# Altium project Project-Files-v2.PrjPcb
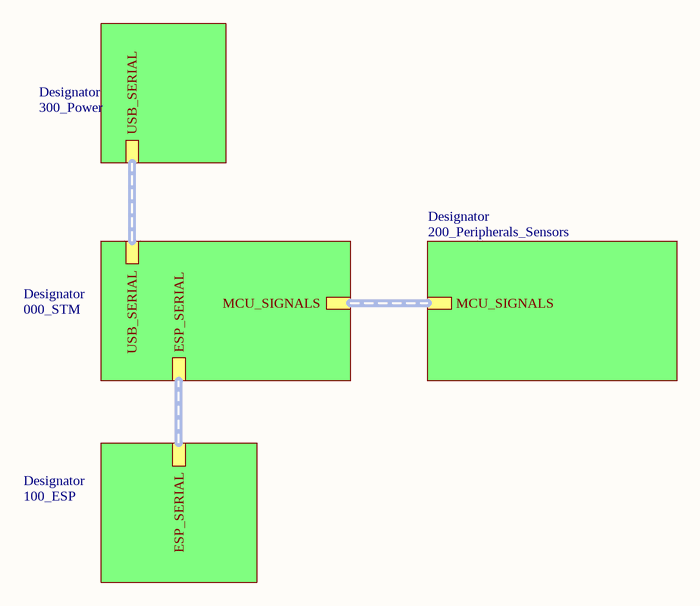
[diagram p0: Main.SchDoc]
5 sheets, 75 parts. Net scope: hierarchical (ports join the sheet entries above them; power ports are global).
Board file: PBC-full.PcbDoc
Sheets:
  Main.SchDoc
    Designator = 000_STM.SchDoc
    Designator = 100_ESP.SchDoc
    Designator = 200_Peripherals_Sensors.SchDoc
    Designator = 300_Power.SchDoc

## Sheet Main.SchDoc
size A; SheetNumber: 1; SheetTotal: 5

### Sub-sheets
Designator = 000_STM: MCU_SIGNALS (harness MCU_SIGNALS), USB_SERIAL (harness USB_SERIAL), ESP_SERIAL (harness ESP_SERIAL)
Designator = 100_ESP: ESP_SERIAL (harness ESP_SERIAL)
Designator = 200_Peripherals_Sensors: MCU_SIGNALS (harness MCU_SIGNALS)
Designator = 300_Power: USB_SERIAL (harness USB_SERIAL)

## Sheet 000_STM.SchDoc
size A; SheetNumber: 2; SheetTotal: 5
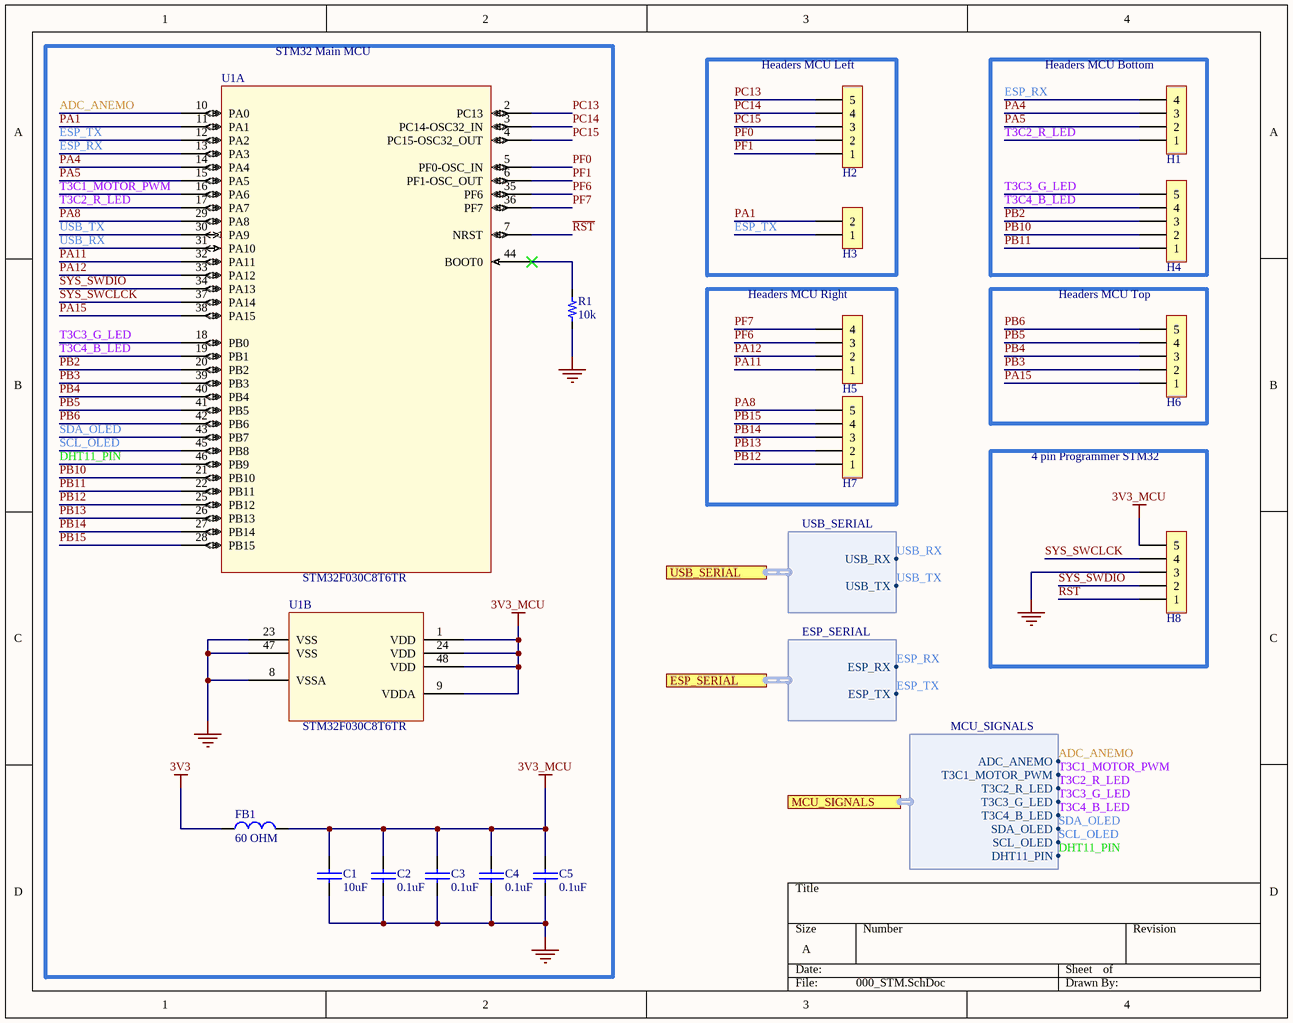
[diagram p1: 000_STM.SchDoc]

### Parts
C1  value 10uF  [0805_cap]  (hidden comment: 10uF 25V)
C2  value 0.1uF  [0603_cap]  (hidden comment: 0.1uF 50V)
C3  value 0.1uF  [0603_cap]  (hidden comment: 0.1uF 50V)
C4  value 0.1uF  [0603_cap]  (hidden comment: 0.1uF 50V)
C5  value 0.1uF  [0603_cap]  (hidden comment: 0.1uF 50V)
FB1  value 60 OHM  [0603_fb]  (hidden comment: 60OHM 2A)
H1  4x1  [H_4x1_TH_2.54mm]  (value not drawn)  (no BOM)
H2  5x1  [H_5x1_TH_100mil]  (value not drawn)  (no BOM)
H3  2x1  [H_2x1_TH_100mil]  (value not drawn)  (no BOM)
H4  5x1  [H_5x1_TH_100mil]  (value not drawn)  (no BOM)
H5  4x1  [H_4x1_TH_2.54mm]  (value not drawn)  (no BOM)
H6  5x1  [H_5x1_TH_100mil]  (value not drawn)  (no BOM)
H7  5x1  [H_5x1_TH_100mil]  (value not drawn)  (no BOM)
H8  5x1  [H_5x1_TH_100mil]  (value not drawn)  (no BOM)
R1  value 10k  [0603_res]  (hidden comment: 10k 1/10W)
U1  STM32F030C8T6TR  [LQFP48_7x7mm]  (parts A,B of 2)

### Blocks framed on the sheet
STM32 Main MCU: C1-C5 FB1 R1 U1
Headers MCU Left: H2 H3
Headers MCU Bottom: H1 H4
Headers MCU Right: H5 H7
Headers MCU Top: H6
4 pin Programmer STM32: H8

### Ports
ESP_SERIAL (harness ESP_SERIAL, see Main[2B], 100_ESP[3A]), MCU_SIGNALS (harness MCU_SIGNALS, see Main[2B], 200_Peripherals_Sensors[1D]), USB_SERIAL (harness USB_SERIAL, see Main[2B], 300_Power[3B])

### Harnesses
MCU_SIGNALS: ADC_ANEMO, T3C1_MOTOR_PWM, T3C2_R_LED, T3C3_G_LED, T3C4_B_LED, SDA_OLED, SCL_OLED, DHT11_PIN
USB_SERIAL: USB_RX, USB_TX
ESP_SERIAL: ESP_RX, ESP_TX

### Nets
3V3: FB1.1
3V3_MCU: C1.1 C2.1 C3.1 C4.1 C5.1 FB1.2 H8.5 U1.1(VDD) U1.9(VDDA) U1.24(VDD) U1.48(VDD)
GND: C1.2 C2.2 C3.2 C4.2 C5.2 H8.3 R1.1 U1.8(VSSA) U1.23(VSS) U1.47(VSS)
ADC_ANEMO: U1.10(PA0) ; port MCU_SIGNALS.ADC_ANEMO
DHT11_PIN: U1.46(PB9) ; port MCU_SIGNALS.DHT11_PIN
ESP_RX: H1.4 U1.13(PA3) ; port ESP_SERIAL.ESP_RX
ESP_TX: H3.1 U1.12(PA2) ; port ESP_SERIAL.ESP_TX
PA1: H3.2 U1.11(PA1)
PA4: H1.3 U1.14(PA4)
PA5: H1.2 U1.15(PA5)
PA8: H7.5 U1.29(PA8)
PA11: H5.1 U1.32(PA11)
PA12: H5.2 U1.33(PA12)
PA15: H6.1 U1.38(PA15)
PB2: H4.3 U1.20(PB2)
PB3: H6.2 U1.39(PB3)
PB4: H6.3 U1.40(PB4)
PB5: H6.4 U1.41(PB5)
PB6: H6.5 U1.42(PB6)
PB10: H4.2 U1.21(PB10)
PB11: H4.1 U1.22(PB11)
PB12: H7.1 U1.25(PB12)
PB13: H7.2 U1.26(PB13)
PB14: H7.3 U1.27(PB14)
PB15: H7.4 U1.28(PB15)
PC13: H2.5 U1.2(PC13)
PC14: H2.4 U1.3(PC14-OSC32_IN)
PC15: H2.3 U1.4(PC15-OSC32_OUT)
PF0: H2.2 U1.5(PF0-OSC_IN)
PF1: H2.1 U1.6(PF1-OSC_OUT)
PF6: H5.3 U1.35(PF6)
PF7: H5.4 U1.36(PF7)
~{RST}: H8.1 U1.7(NRST)
SCL_OLED: U1.45(PB8) ; port MCU_SIGNALS.SCL_OLED
SDA_OLED: U1.43(PB7) ; port MCU_SIGNALS.SDA_OLED
SYS_SWCLCK: H8.4 U1.37(PA14)
SYS_SWDIO: H8.2 U1.34(PA13)
T3C1_MOTOR_PWM: U1.16(PA6) ; port MCU_SIGNALS.T3C1_MOTOR_PWM
T3C2_R_LED: H1.1 U1.17(PA7) ; port MCU_SIGNALS.T3C2_R_LED
T3C3_G_LED: H4.5 U1.18(PB0) ; port MCU_SIGNALS.T3C3_G_LED
T3C4_B_LED: H4.4 U1.19(PB1) ; port MCU_SIGNALS.T3C4_B_LED
USB_RX: U1.31(PA10) ; port USB_SERIAL.USB_RX
USB_TX: U1.30(PA9) ; port USB_SERIAL.USB_TX
NetR1_2: R1.2 U1.44(BOOT0)

### Library data of the parts
C1 = Cap_10uF_0805_25V_: 25V 10uF X5R ±10% 0805 Multilayer Ceramic Capacitors MLCC - SMD/SMT ROHS; Manufacturer: Samsung Electro-Mechanics; Manufacturer Part Number: CL21A106KAYNNNE; Supplier 1: LCSC; Supplier Part Number 1: C15850; ComponentLink1Description: LCSC; ComponentLink1URL: https://lcsc.com/product-detail/Multilayer-Ceramic-Capacitors-MLCC-SMD-SMT_Samsung-Electro-Mechanics-CL21A106KAYNNNE_C15850.html
C2-C5 = Cap_0.1uF_0603_50V: 50V 100nF Y5V -20%~+80% 0603 Multilayer Ceramic Capacitors MLCC - SMD/SMT ROHS; Manufacturer: Walsin Tech Corp; Manufacturer Part Number: 0603F104Z500CT; Supplier 1: LCSC; Supplier Part Number 1: C83060; ComponentLink1Description: LCSC; ComponentLink1URL: https://www.lcsc.com/product-detail/Multilayer-Ceramic-Capacitors-MLCC-SMD-SMT_Walsin-Tech-Corp-0603F104Z500CT_C83060.html
FB1 = FB_60_0603_2A: 2A 1 100mΩ 60Ω@100MHz ±25% 0603 Ferrite Beads ROHS; Manufacturer: TAI-TECH; Manufacturer Part Number: HCB1608KF-600T20; ComponentLink1Description: LCSC; ComponentLink1URL: https://www.lcsc.com/product-detail/Ferrite-Beads_TAI-TECH-HCB1608KF-600T20_C369516.html; Supplier 1: LCSC; Supplier Part Number 1: C369516
H1 H5 = H_Male_4x1_TH_100mil: ComponentLink1Description: LCSC
H2 H4 H6-H8 = H_Male_5x1_TH_100mil: ComponentLink1Description: LCSC
H3 = H_Male_2x1_TH_100mil: ComponentLink1Description: LCSC
R1 = Res_10k_0603_1/10W: RES SMD 10k OHM 5% 1/10W 0603; Manufacturer: FOJAN; Manufacturer Part Number: FRC0603J103TS; ComponentLink1URL: https://www.lcsc.com/product-detail/Chip-Resistor-Surface-Mount_FOJAN-FRC0603J103TS_C2930027.html; Supplier 1: LCSC; Supplier Part Number 1: C2930027; ComponentLink1Description: LCSC
U1 = IC_STM32F030C8T6TR_LQFP48_7x7MM: IC MCU 32BIT 64KB FLASH 48LQFP; Manufacturer: STMicroelectronics; Manufacturer part number: STM32F030C8T6TR; Supplier 1: LCSC; Supplier Part Number 1: C23922; ComponentLink1Description: LCSC; ComponentLink1URL: https://www.lcsc.com/product-detail/ST-Microelectronics_STMicroelectronics-STM32F030C8T6_C23922.html

## Sheet 100_ESP.SchDoc
size A; SheetNumber: 3; SheetTotal: 5
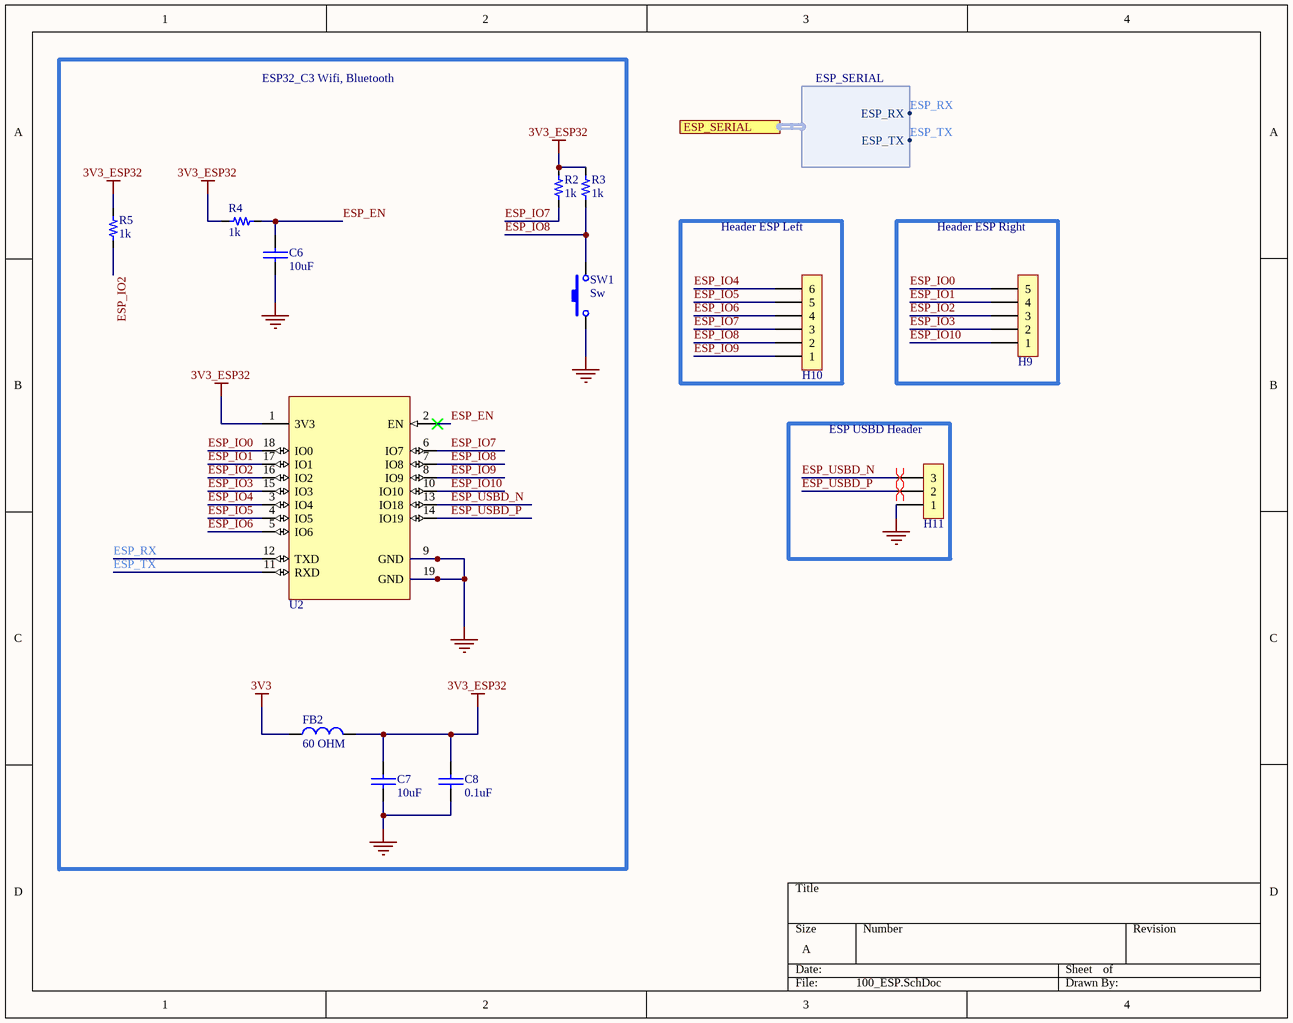
[diagram p2: 100_ESP.SchDoc]

### Parts
C6  value 10uF  [0805_cap]  (hidden comment: 10uF 25V)
C7  value 10uF  [0805_cap]  (hidden comment: 10uF 25V)
C8  value 0.1uF  [0603_cap]  (hidden comment: 0.1uF 50V)
FB2  value 60 OHM  [0603_fb]  (hidden comment: 60OHM 2A)
H9  5x1  [H_5x1_TH_100mil]  (value not drawn)  (no BOM)
H10  6x1  [H_6x1_TH_100mil]  (value not drawn)  (no BOM)
H11  3x1  [H_3X1_TH_100mil]  (value not drawn)  (no BOM)
R2  value 1k  [0603_res]  (hidden comment: 1k 1/10W)
R3  value 1k  [0603_res]  (hidden comment: 1k 1/10W)
R4  value 1k  [0603_res]  (hidden comment: 1k 1/10W)
R5  value 1k  [0603_res]  (hidden comment: 1k 1/10W)
SW1  Sw  [Sw_PUSH_4.5x4.5x5mm]
U2  ESP32-C3-WROOM-02-N4  [ESP32-C3-WROOM-02-N4]  (value not drawn)

### Blocks framed on the sheet
ESP32_C3 Wifi, Bluetooth: C6-C8 FB2 R2-R5 SW1 U2
Header ESP Left: H10
Header ESP Right: H9
ESP USBD Header: H11

### Ports
ESP_SERIAL (harness ESP_SERIAL, see Main[2B], 000_STM[3C])

### Harnesses
ESP_SERIAL: ESP_RX, ESP_TX

### Nets
3V3: FB2.1
3V3_ESP32: C7.1 C8.1 FB2.2 R2.2 R3.2 R4.2 R5.2 U2.1(3V3)
GND: C6.2 C7.2 C8.2 H11.1 SW1.1 U2.9(GND) U2.19(GND)
ESP_EN: C6.1 R4.1 U2.2(EN)
ESP_IO0: H9.5 U2.18(IO0)
ESP_IO1: H9.4 U2.17(IO1)
ESP_IO2: H9.3 R5.1 U2.16(IO2)
ESP_IO3: H9.2 U2.15(IO3)
ESP_IO4: H10.6 U2.3(IO4)
ESP_IO5: H10.5 U2.4(IO5)
ESP_IO6: H10.4 U2.5(IO6)
ESP_IO7: H10.3 R2.1 U2.6(IO7)
ESP_IO8: H10.2 R3.1 SW1.2 U2.7(IO8)
ESP_IO9: H10.1 U2.8(IO9)
ESP_IO10: H9.1 U2.10(IO10)
ESP_RX: U2.12(TXD) ; port ESP_SERIAL.ESP_RX
ESP_TX: U2.11(RXD) ; port ESP_SERIAL.ESP_TX
ESP_USBD_N: H11.3 U2.13(IO18)
ESP_USBD_P: H11.2 U2.14(IO19)

### Layout directives
differential pair; differential pair class USB_2.0_ESP: ESP_USBD_N, ESP_USBD_P

### Library data of the parts
C6 C7 = Cap_10uF_0805_25V_: as C1 on sheet 000_STM; Supplier 1: LCSC; Supplier Part Number 1: C15850; ComponentLink1Description: LCSC; ComponentLink1URL: https://lcsc.com/product-detail/Multilayer-Ceramic-Capacitors-MLCC-SMD-SMT_Samsung-Electro-Mechanics-CL21A106KAYNNNE_C15850.html
C8 = Cap_0.1uF_0603_50V: as C2 on sheet 000_STM; Supplier 1: LCSC; Supplier Part Number 1: C83060; ComponentLink1Description: LCSC; ComponentLink1URL: https://www.lcsc.com/product-detail/Multilayer-Ceramic-Capacitors-MLCC-SMD-SMT_Walsin-Tech-Corp-0603F104Z500CT_C83060.html
FB2 = FB_60_0603_2A: as FB1 on sheet 000_STM; ComponentLink1Description: LCSC; ComponentLink1URL: https://www.lcsc.com/product-detail/Ferrite-Beads_TAI-TECH-HCB1608KF-600T20_C369516.html; Supplier 1: LCSC; Supplier Part Number 1: C369516
H9 = H_Male_5x1_TH_100mil: ComponentLink1Description: LCSC
H10 = H_Male_6x1_TH_100mil: ComponentLink1Description: LCSC
H11 = H_Male_3x1_TH_100mil: ComponentLink1Description: LCSC
R2-R5 = Res_1k_0603_1/10W: RES SMD 1k OHM 5% 1/10W 0603; Manufacturer: FOJAN; Manufacturer Part Number: FRC0603J102 TS; ComponentLink1URL: https://www.lcsc.com/product-detail/Chip-Resistor-Surface-Mount_FOJAN-FRC0603J102-TS_C2907113.html; Supplier 1: LCSC; Supplier Part Number 1: C2907113; ComponentLink1Description: LCSC
SW1 = Sw_PUSH_4.5x4.5x5.0xmm: SWITCH TACTILE SPST-NO 0.05A 12V; Manufacturer: BZCN; Manufacturer Part Number: TSC015A05026A; Supplier 1: LCSC; Supplier Part Number 1: C2888509; Last modified by: N-A.Potosi; Last modified date: 20190222; ComponentLink1Description: LCSC; ComponentLink1URL: https://www.lcsc.com/product-detail/Tactile-Switches_BZCN-TSC015A05026A_C2888509.html
U2 = MCU_ESP32-C3-WROOM-02-N4: RF TXRX MOD BT WIFI PCB TH SMD; Manufacturer: Espressif Systems; Manufacturer Part Number: ESP32-C3-WROOM-02-N4; Supplier 1: LCSC; Supplier Part Number 1: C2934560; ComponentLink1Description: LCSC; ComponentLink1URL: https://lcsc.com/product-detail/WiFi-Modules_Espressif-Systems-ESP32-C3-WROOM-02-N4_C2934560.html

## Sheet 200_Peripherals_Sensors.SchDoc
size A; SheetNumber: 4; SheetTotal: 5
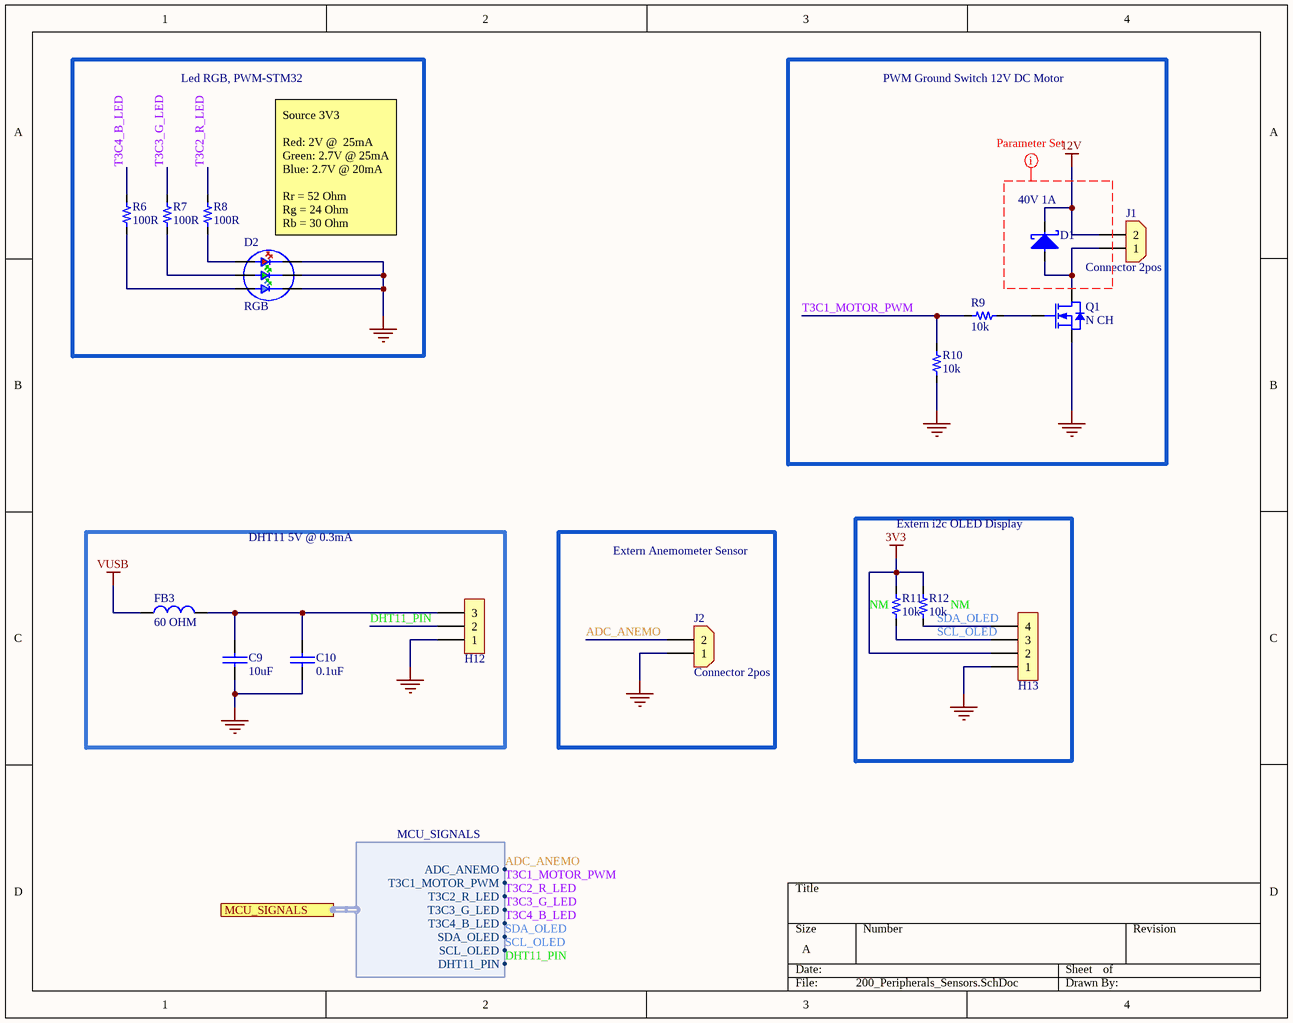
[diagram p3: 200_Peripherals_Sensors.SchDoc]

### Parts
C9  value 10uF  [0805_cap]  (hidden comment: 10uF 25V)
C10  value 0.1uF  [0603_cap]  (hidden comment: 0.1uF 50V)
D1  40V 1A  [SOD_123]
D2  RGB  [RGB_NS_3.5X3.7]
FB3  value 60 OHM  [0603_fb]  (hidden comment: 60OHM 2A)
H12  3x1  [H_3X1_TH_100mil]  (value not drawn)  (no BOM)
H13  4x1  [H_4x1_TH_2.54mm]  (value not drawn)  (no BOM)
J1  Connector 2pos  [CON_2x1_TH_5MM]
J2  Connector 2pos  [CON_2x1_TH_5MM]
Q1  N CH  [SOT_23_3]
R6  value 100R  [0603_res]  (hidden comment: 100R 1/10W)
R7  value 100R  [0603_res]  (hidden comment: 100R 1/10W)
R8  value 100R  [0603_res]  (hidden comment: 100R 1/10W)
R9  value 10k  [0603_res]  (hidden comment: 10k 1/10W)
R10  value 10k  [0603_res]  (hidden comment: 10k 1/10W)
R11  value 10k  Usage: NM  [0603_res]  (hidden comment: 10k 1/10W)
R12  value 10k  Usage: NM  [0603_res]  (hidden comment: 10k 1/10W)

### Blocks framed on the sheet
Led RGB, PWM-STM32: D2 R6-R8
PWM Ground Switch 12V DC Motor: D1 J1 Q1 R9 R10
DHT11 5V @ 0.3mA: C9 C10 FB3 H12
Extern Anemometer Sensor: J2
Extern i2c OLED Display: H13 R11 R12

### Ports
MCU_SIGNALS (harness MCU_SIGNALS, see Main[3B], 000_STM[3D])

### Harnesses
MCU_SIGNALS: ADC_ANEMO, T3C1_MOTOR_PWM, T3C2_R_LED, T3C3_G_LED, T3C4_B_LED, SDA_OLED, SCL_OLED, DHT11_PIN

### Nets
3V3: H13.2 R11.2 R12.2
12V: D1.1 J1.2
GND: C9.2 C10.2 D2.1 D2.2 D2.3 H12.1 H13.1 J2.1 Q1.2(S) R10.1
VUSB: FB3.1
ADC_ANEMO: J2.2 ; port MCU_SIGNALS.ADC_ANEMO
DHT11_PIN: H12.2 ; port MCU_SIGNALS.DHT11_PIN
SCL_OLED: H13.3 R11.1 ; port MCU_SIGNALS.SCL_OLED
SDA_OLED: H13.4 R12.1 ; port MCU_SIGNALS.SDA_OLED
T3C1_MOTOR_PWM: R9.2 R10.2 ; port MCU_SIGNALS.T3C1_MOTOR_PWM
T3C2_R_LED: R8.2 ; port MCU_SIGNALS.T3C2_R_LED
T3C3_G_LED: R7.2 ; port MCU_SIGNALS.T3C3_G_LED
T3C4_B_LED: R6.2 ; port MCU_SIGNALS.T3C4_B_LED
NetC9_1: C9.1 C10.1 FB3.2 H12.3
NetD1_2: D1.2 J1.1 Q1.3(D)
NetD2_4: D2.4 R8.1
NetD2_5: D2.5 R7.1
NetD2_6: D2.6 R6.1
NetQ1_1: Q1.1(G) R9.1

### Layout directives
net class 12V_2A: (no net found under the mark)

### Notes on the sheet
- (near D2) Source 3V3
  Red: 2V @  25mA
  Green: 2.7V @ 25mA
  Blue: 2.7V @ 20mA
  Rr = 52 Ohm
  Rg = 24 Ohm
  Rb = 30 Ohm

### Library data of the parts
C9 = Cap_10uF_0805_25V_: as C1 on sheet 000_STM; Supplier 1: LCSC; Supplier Part Number 1: C15850; ComponentLink1Description: LCSC; ComponentLink1URL: https://lcsc.com/product-detail/Multilayer-Ceramic-Capacitors-MLCC-SMD-SMT_Samsung-Electro-Mechanics-CL21A106KAYNNNE_C15850.html
C10 = Cap_0.1uF_0603_50V: as C2 on sheet 000_STM; Supplier 1: LCSC; Supplier Part Number 1: C83060; ComponentLink1Description: LCSC; ComponentLink1URL: https://www.lcsc.com/product-detail/Multilayer-Ceramic-Capacitors-MLCC-SMD-SMT_Walsin-Tech-Corp-0603F104Z500CT_C83060.html
D1 = D_Schottky_40V_1A_SOD_123F: DIODE SCHOTTKY 40V 1A SOD123F; Manufacturer: Shanghai Prisemi Elec; Manufacturer Part Number: PSBD1DF40V1H; Supplier 1: LCSC; Supplier Part Number 1: C110730; ComponentLink1Description: LCSC; ComponentLink1URL: https://www.lcsc.com/product-detail/Switching-Diode_Shanghai-Prisemi-Elec-PSBD1DF40V1H_C110730.html
D2 = LED_RGB_3535_SMD: -30℃~+85℃ RGB 110° 3535(mm) Light Emitting Diodes (LED) ROHS; Manufacturer: Foshan NationStar Optoelectronics; Manufacturer Part Number: RS-3535MWAM; Supplier 1: LCSC; Supplier Part Number 1: C842778; ComponentLink1Description: LCSC; ComponentLink1URL: https://www.lcsc.com/product-detail/Light-Emitting-Diodes-LED_Foshan-NationStar-Optoelectronics-RS-3535MWAM_C842778.html
FB3 = FB_60_0603_2A: as FB1 on sheet 000_STM; ComponentLink1Description: LCSC; ComponentLink1URL: https://www.lcsc.com/product-detail/Ferrite-Beads_TAI-TECH-HCB1608KF-600T20_C369516.html; Supplier 1: LCSC; Supplier Part Number 1: C369516
H12 = H_Male_3x1_TH_100mil: ComponentLink1Description: LCSC
H13 = H_Male_4x1_TH_100mil: ComponentLink1Description: LCSC
J1 J2 = Con_2x1_TH_5mm: 2POS 5MM; Manufacturer: JILN; Manufacturer Part Number: JL126-50002G01; Supplier 1: LCSC; Supplier Part Number 1: C394556; ComponentLink1Description: Digi-Key; ComponentLink1URL: https://www.lcsc.com/product-detail/Screw-terminal_JILN-JL126-50002G01_C394556.html
Q1 = Q_NFET_20V_3.2A_SOT23: MOSFET N-CH 20V SOT23; Manufacturer: Doeshare; Manufacturer Part Number: DN2302S; Supplier 1: LCSC; Supplier Part Number 1: C2931750; ComponentLink1Description: LCSC; ComponentLink1URL: https://www.lcsc.com/product-detail/MOSFETs_Doeshare-DN2302S_C2931750.html
R6-R8 = Res_100R_0603_1/10W: RES SMD 100R OHM 5% 1/10W 0603; Manufacturer: FOJAN; Manufacturer Part Number: FRC0603J101 TS; ComponentLink1URL: https://www.lcsc.com/product-detail/Chip-Resistor-Surface-Mount_FOJAN-FRC0603J101-TS_C2907089.html; Supplier 1: LCSC; Supplier Part Number 1: C2907089; ComponentLink1Description: LCSC
R9-R12 = Res_10k_0603_1/10W: as R1 on sheet 000_STM; ComponentLink1URL: https://www.lcsc.com/product-detail/Chip-Resistor-Surface-Mount_FOJAN-FRC0603J103TS_C2930027.html; Supplier 1: LCSC; Supplier Part Number 1: C2930027; ComponentLink1Description: LCSC

## Sheet 300_Power.SchDoc
size A; SheetNumber: 5; SheetTotal: 5
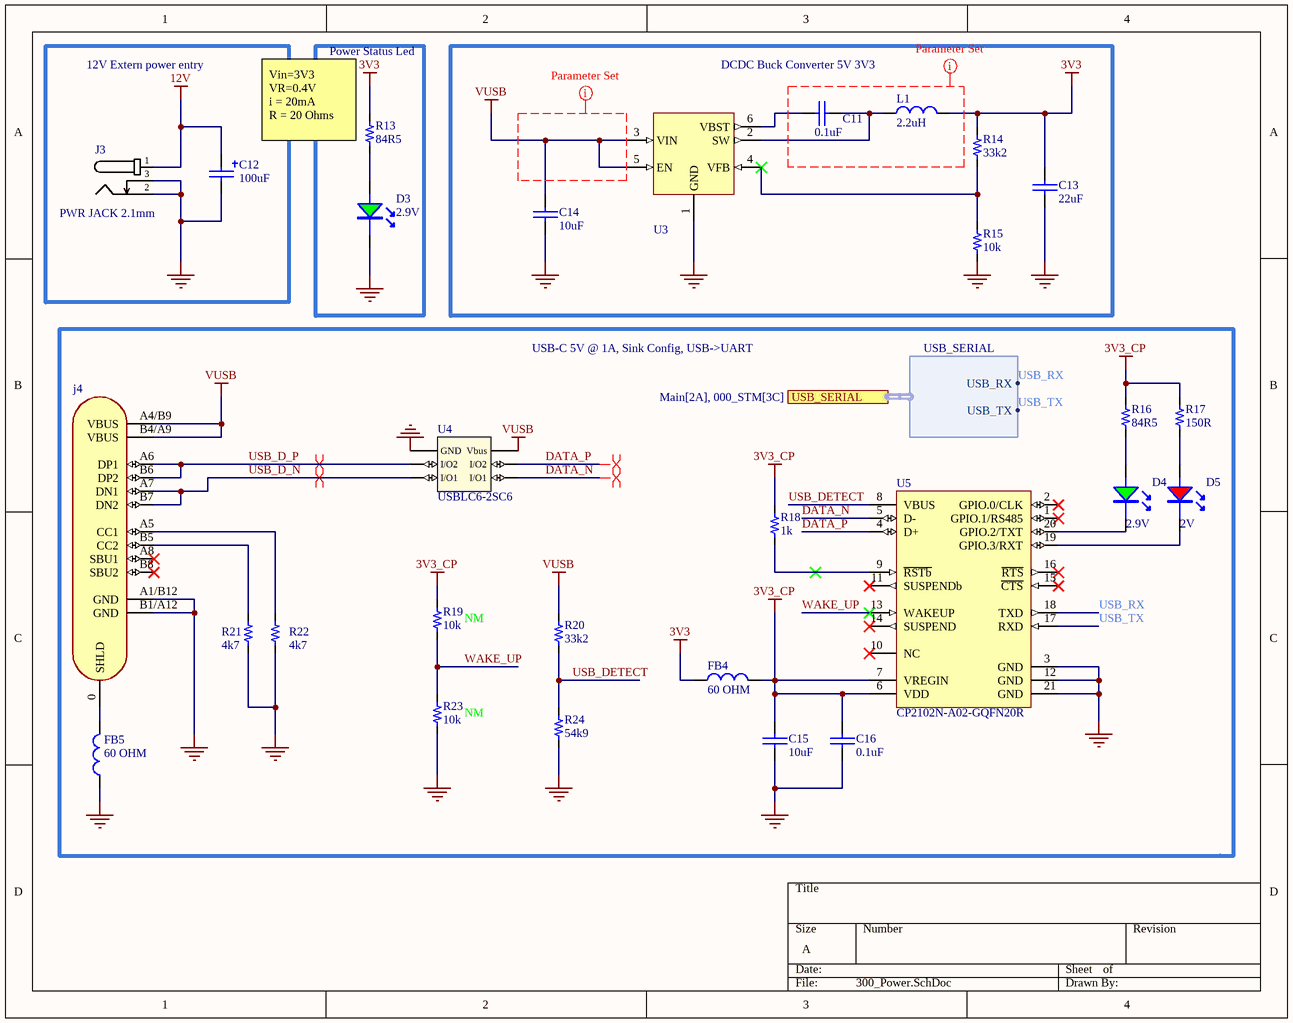
[diagram p4: 300_Power.SchDoc]

### Parts
C11  value 0.1uF  [0603_cap]  (hidden comment: 0.1uF 50V)
C12  value 100uF  [CAP_TH_2.5MM_6.3*12MM]  (hidden comment: 100uF 35V)
C13  value 22uF  [0603_cap]  (hidden comment: 22uF 10V)
C14  value 10uF  [0603_cap]  (hidden comment: 10uF 10V)
C15  value 10uF  [0603_cap]  (hidden comment: 10uF 10V)
C16  value 0.1uF  [0603_cap]  (hidden comment: 0.1uF 50V)
D3  2.9V  [0805_LED]
D4  2.9V  [0805_LED]
D5  2V  [0805_LED]
FB4  value 60 OHM  [0603_fb]  (hidden comment: 60OHM 2A)
FB5  value 60 OHM  [0603_fb]  (hidden comment: 60OHM 2A)
J3  PWR JACK 2.1mm  [CON_POWER_BARREL_2.1MM_3CONN]
j4  USB C  [CON_USB_C_16P_RA]  (value not drawn)
L1  value 2.2uH  [Ind_5.8*5.2_NS]  (hidden comment: 2.2uH 4A)
R13  value 84R5  [0603_res]  (hidden comment: 84R5 1/10W)
R14  value 33k2  [0603_res]  (hidden comment: 33k2 1/10W)
R15  value 10k  [0603_res]  (hidden comment: 10k 1/10W)
R16  value 84R5  [0603_res]  (hidden comment: 84R5 1/10W)
R17  value 150R  [0603_res]  (hidden comment: 150R 1/10W)
R18  value 1k  [0603_res]  (hidden comment: 1k 1/10W)
R19  value 10k  Usage: NM  [0603_res]  (hidden comment: 10k 1/10W)
R20  value 33k2  [0603_res]  (hidden comment: 33k2 1/10W)
R21  value 4k7  [0603_res]  (hidden comment: 4k7 1/10W)
R22  value 4k7  [0603_res]  (hidden comment: 4k7 1/10W)
R23  value 10k  Usage: NM  [0603_res]  (hidden comment: 10k 1/10W)
R24  value 54k9  [0603_res]  (hidden comment: 54k9 1/10W)
U3  TPS564201DDCR  [SOT_23_6]  (value not drawn)
U4  USBLC6-2SC6  [SOT_23_6]
U5  CP2102N-A02-GQFN20R  [WFQFN_20_EP_3X3MM]

### Blocks framed on the sheet
12V Extern power entry: C12 J3
Power Status Led: D3 R13
DCDC Buck Converter 5V 3V3: C11 C13 C14 L1 R14 R15 U3
USB-C 5V @ 1A, Sink Config, USB->UART: C15 C16 D4 D5 FB4 FB5 j4 R16-R24 U4 U5

### Ports
USB_SERIAL (harness USB_SERIAL, see Main[2A], 000_STM[3C])

### Harnesses
USB_SERIAL: USB_RX, USB_TX

### Nets
3V3: C13.1 FB4.1 L1.2 R13.1 R14.2
3V3_CP: C15.1 C16.1 FB4.2 R16.2 R17.2 R18.2 R19.2 U5.6(VDD) U5.7(VREGIN)
12V: C12.1 J3.1
GND: C12.2 C13.2 C14.2 C15.2 C16.2 D3.2 FB5.1 J3.2 J3.3 j4.A1/B12(GND) j4.B1/A12(GND) R15.1 R21.1 R22.1 R23.1 R24.1 U3.1(GND) U4.2(GND) U5.3(GND) U5.12(GND) U5.21(GND)
VUSB: C14.1 j4.A4/B9(VBUS) j4.B4/A9(VBUS) R20.2 U3.3(VIN) U3.5(EN) U4.5(Vbus)
DATA_N: U4.6(I/O1) U5.5(D-)
DATA_P: U4.4(I/O2) U5.4(D+)
USB_D_N: j4.A7(DN1) j4.B7(DN2) U4.1(I/O1)
USB_D_P: j4.A6(DP1) j4.B6(DP2) U4.3(I/O2)
USB_DETECT: R20.1 R24.2 U5.8(VBUS)
USB_RX: U5.18(TXD) ; port USB_SERIAL.USB_RX
USB_TX: U5.17(RXD) ; port USB_SERIAL.USB_TX
WAKE_UP: R19.1 R23.2 U5.13(WAKEUP)
NetC11_1: C11.1 L1.1 U3.2(SW)
NetC11_2: C11.2 U3.6(VBST)
NetD3_1: D3.1(A) R13.2
NetD4_1: D4.1(A) R16.1
NetD4_2: D4.2 U5.20(GPIO.2/TXT)
NetD5_1: D5.1(A) R17.1
NetD5_2: D5.2 U5.19(GPIO.3/RXT)
NetFB5_2: FB5.2 j4.0(SHLD)
Netj4_A5: j4.A5(CC1) R22.2
Netj4_B5: j4.B5(CC2) R21.2
NetR14_1: R14.1 R15.2 U3.4(VFB)
NetR18_1: R18.1 U5.9(~{RSTb})

Not connected (* = marked no-connect by the designer): j4 A8(SBU1)* B8(SBU2)*; U5 1(GPIO.1/RS485)* 2(GPIO.0/CLK)* 10(NC)* 11(SUSPENDb)* 14(SUSPEND)* 15(~{CTS})* 16(~{RTS})*

### Layout directives
differential pair; differential pair class USB_2.0_MCU: DATA_N, DATA_P, USB_D_N, USB_D_P
net class 5V_1A: (no net found under the mark)

### Notes on the sheet
- (near R13) Vin=3V3
  VR=0.4V
  i = 20mA
  R = 20 Ohms

### Library data of the parts
C11 C16 = Cap_0.1uF_0603_50V: as C2 on sheet 000_STM; Supplier 1: LCSC; Supplier Part Number 1: C83060; ComponentLink1Description: LCSC; ComponentLink1URL: https://www.lcsc.com/product-detail/Multilayer-Ceramic-Capacitors-MLCC-SMD-SMT_Walsin-Tech-Corp-0603F104Z500CT_C83060.html
C12 = Cap_100uF_ALU_TH_35V: 100uF 35V ±20% Plugin,D6.3xL12mm Aluminum Electrolytic Capacitors - Leaded ROHS; Manufacturer: HRK; Manufacturer Part Number: 35V100uF CD110; Supplier 1: LCSC; Supplier Part Number 1: C2960381; ComponentLink1Description: LCSC; ComponentLink1URL: https://lcsc.com/product-detail/Aluminum-Electrolytic-Capacitors-Leaded_HRK-35V100uF-CD110_C2960381.html
C13 = Cap_22uF_0603_10V: 10V 22uF X5R ±20% 0603 Multilayer Ceramic Capacitors MLCC - SMD/SMT ROHS; Manufacturer: HRE; Manufacturer Part Number: CGA0603X5R226M100JT; Supplier 1: LCSC; Supplier Part Number 1: C6119863; ComponentLink1Description: LCSC; ComponentLink1URL: https://lcsc.com/product-detail/Multilayer-Ceramic-Capacitors-MLCC-SMD-SMT_HRE-CGA0603X5R226M100JT_C6119863.html
C14 C15 = Cap_10uF_0603_10V: 10V 10uF X5R ±10% 0603 Multilayer Ceramic Capacitors MLCC - SMD/SMT ROHS; Manufacturer: CCTC; Manufacturer Part Number: TCC0603X5R106K100CT; Supplier 1: LCSC; Supplier Part Number 1: C380314; ComponentLink1Description: LCSC; ComponentLink1URL: https://www.lcsc.com/product-detail/Multilayer-Ceramic-Capacitors-MLCC-SMD-SMT_CCTC-TCC0603X5R106K100CT_C380314.html
D3 D4 = LED_0805_Green: LED GREEN CLEAR 0805 SMD; Manufacturer: XINGLIGHT; Manufacturer Part Number: XL-2012UGC; Supplier 1: LCSC; Supplier Part Number 1: C965815; ComponentLink1Description: LCSC; ComponentLink1URL: https://www.lcsc.com/product-detail/Light-Emitting-Diodes-LED_XINGLIGHT-XL-2012UGC_C965815.html
D5 = LED_0805_RED: LED RED CLEAR 0805 SMD; Manufacturer: XINGLIGHT; Manufacturer Part Number: XL-2012SURC; Supplier 1: LCSC; Supplier Part Number 1: C965812; ComponentLink1Description: LCSC; ComponentLink1URL: https://www.lcsc.com/product-detail/Light-Emitting-Diodes-LED_XINGLIGHT-XL-2012SURC_C965812.html
FB4 FB5 = FB_60_0603_2A: as FB1 on sheet 000_STM; ComponentLink1Description: LCSC; ComponentLink1URL: https://www.lcsc.com/product-detail/Ferrite-Beads_TAI-TECH-HCB1608KF-600T20_C369516.html; Supplier 1: LCSC; Supplier Part Number 1: C369516
J3 = Con_Power_Jack_2.1mm_3pins: CONN PWR JACK 2X5.5MM SOLDER; Manufacturer: HCTL; Manufacturer Part Number: HC-DC-005-2.0T; Supplier 1: LCSC; Supplier Part Number 1: C3010533; ComponentLink1Description: LCSC; ComponentLink1URL: https://www.lcsc.com/product-detail/AC-DC-Power-Connectors_HCTL-HC-DC-005-2-0T_C3010533.html
j4 = CON_USB_TYPEC_16P: 3A USB 3.1 1 Surface Mount 16P Female -40℃~+85℃ Type-C SMD USB Connectors ROHS; Manufacturer: SHOU HAN; Manufacturer Part Number: TYPE-C-3.1-16PIN; Supplier 1: LCSC; Supplier Part Number 1: C7507405; ComponentLink1Description: LCSC; ComponentLink1URL: https://lcsc.com/product-detail/USB-Connectors_SHOU-HAN-TYPE-C-3-1-16PIN_C7507405.html
L1 = Inductor_2.2uH_4A_5.8*5.2mm: 4A 2.2uH ±20% 22.1mΩ SMD,5.8x5.2mm Inductors (SMD) ROHS; Manufacturer: SHOU HAN; Manufacturer Part Number: CY54-2.2UH; Supplier 1: LCSC; Supplier Part Number 1: C2929427; ComponentLink1Description: LCSC; ComponentLink1URL: https://lcsc.com/product-detail/Inductors-SMD_SHOU-HAN-CY54-2-2UH_C2929427.html
R13 R16 = Res_84R5_0603_1/10W: 100mW Thick Film Resistor 50V ±100ppm/℃ ±1% 84.5Ω 0603 Chip Resistor - Surface Mount ROHS; Manufacturer: LIZ Elec; Manufacturer Part Number: CR0603FA84R5G; ComponentLink1URL: https://lcsc.com/product-detail/Chip-Resistor-Surface-Mount_LIZ-Elec-CR0603FA84R5G_C101216.html; Supplier 1: LCSC; Supplier Part Number 1: C101216; ComponentLink1Description: LCSC
R14 R20 = Res_33k2_0603_1/10W: 100mW Thick Film Resistor 75V ±100ppm/℃ ±1% 33.2kΩ 0603 Chip Resistor - Surface Mount ROHS; Manufacturer: YAGEO; Manufacturer Part Number: RC0603FR-0733K2L; ComponentLink1URL: https://lcsc.com/product-detail/Chip-Resistor-Surface-Mount_YAGEO-RC0603FR-0733K2L_C185338.html; Supplier 1: LCSC; Supplier Part Number 1: C185338; ComponentLink1Description: LCSC
R15 R19 R23 = Res_10k_0603_1/10W: as R1 on sheet 000_STM; ComponentLink1URL: https://www.lcsc.com/product-detail/Chip-Resistor-Surface-Mount_FOJAN-FRC0603J103TS_C2930027.html; Supplier 1: LCSC; Supplier Part Number 1: C2930027; ComponentLink1Description: LCSC
R17 = Res_150R_0603_1/10W: 100mW Thick Film Resistor 75V ±100ppm/℃ ±1% 150Ω 0603 Chip Resistor - Surface Mount ROHS; Manufacturer: RALEC; Manufacturer Part Number: RTT031500FTP; ComponentLink1URL: https://lcsc.com/product-detail/Chip-Resistor-Surface-Mount_RALEC-RTT031500FTP_C103302.html; Supplier 1: LCSC; Supplier Part Number 1: C103302; ComponentLink1Description: LCSC
R18 = Res_1k_0603_1/10W: as R2 on sheet 100_ESP; ComponentLink1URL: https://www.lcsc.com/product-detail/Chip-Resistor-Surface-Mount_FOJAN-FRC0603J102-TS_C2907113.html; Supplier 1: LCSC; Supplier Part Number 1: C2907113; ComponentLink1Description: LCSC
R21 R22 = Res_4k7_0603_1/10W: 100mW Thick Film Resistor 75V ±1% 4.7kΩ 0603 Chip Resistor - Surface Mount ROHS; Manufacturer: VO; Manufacturer Part Number: SCR0603F4K7; ComponentLink1URL: https://lcsc.com/product-detail/Chip-Resistor-Surface-Mount_VO-SCR0603F4K7_C3016318.html; Supplier 1: LCSC; Supplier Part Number 1: C3016318; ComponentLink1Description: LCSC
R24 = Res_54k9_0603_1/10W: 100mW Thick Film Resistor 75V ±100ppm/℃ ±1% 54.9kΩ 0603 Chip Resistor - Surface Mount ROHS; Manufacturer: YAGEO; Manufacturer Part Number: RC0603FR-0754K9L; ComponentLink1URL: https://lcsc.com/product-detail/Chip-Resistor-Surface-Mount_YAGEO-RC0603FR-0754K9L_C185321.html; Supplier 1: LCSC; Supplier Part Number 1: C185321; ComponentLink1Description: LCSC
U3 = DCDC_SW_BUCK_4A_SOT23-6: IC REG BUCK ADJ 4A SOT23; Manufacturer: Texas Instruments; Manufacturer Part Number: TPS564201DDCR; Supplier 1: LCSC; Supplier Part Number 1: C464812; ComponentLink1Description: LCSC; ComponentLink1URL: https://lcsc.com/product-detail/DC-DC-Converters_Texas-Instruments-TPS564201DDCR_C464812.html
U4 = TVS_5.25V_2CH_SOT_23_6: TVS DIODE 5.25V 17V SOT23-6; Manufacturer: STMicroelectronics; ComponentLink1Description: LCSC; ComponentLink1URL: https://www.lcsc.com/product-detail/ESD-Protection-Devices_STMicroelectronics-USBLC6-2SC6_C7519.html; Supplier 1: LCSC; Manufacturer Part Number: USBLC6-2SC6; Supplier Part Number 1: C7519
U5 = IC_SGL_USB2UART-BRIDGE_20QFN: IC USB TO UART BRIDGE QFN20; Manufacturer: Silicon Labs; Manufacturer Part Number: CP2102N-A02-GQFN20R; Supplier 1: LCSC; Supplier Part Number 1: C969913; ComponentLink1Description: LCSC; ComponentLink1URL: https://www.lcsc.com/product-detail/USB-ICs_SILICON-LABS-CP2102N-A02-GQFN20R_C969913.html

## Nets that join several sheets
3V3: 000_STM (FB1.1), 100_ESP (FB2.1), 200_Peripherals_Sensors (H13.2 R11.2 R12.2), 300_Power (5 pins)
12V: 200_Peripherals_Sensors (D1.1 J1.2), 300_Power (C12.1 J3.1)
GND: 000_STM (10 pins), 100_ESP (7 pins), 200_Peripherals_Sensors (10 pins), 300_Power (21 pins)
VUSB: 200_Peripherals_Sensors (FB3.1), 300_Power (7 pins)
ADC_ANEMO: 000_STM (U1.10), 200_Peripherals_Sensors (J2.2)
DHT11_PIN: 000_STM (U1.46), 200_Peripherals_Sensors (H12.2)
ESP_RX: 000_STM (H1.4 U1.13), 100_ESP (U2.12)
ESP_TX: 000_STM (H3.1 U1.12), 100_ESP (U2.11)
SCL_OLED: 000_STM (U1.45), 200_Peripherals_Sensors (H13.3 R11.1)
SDA_OLED: 000_STM (U1.43), 200_Peripherals_Sensors (H13.4 R12.1)
T3C1_MOTOR_PWM: 000_STM (U1.16), 200_Peripherals_Sensors (R9.2 R10.2)
T3C2_R_LED: 000_STM (H1.1 U1.17), 200_Peripherals_Sensors (R8.2)
T3C3_G_LED: 000_STM (H4.5 U1.18), 200_Peripherals_Sensors (R7.2)
T3C4_B_LED: 000_STM (H4.4 U1.19), 200_Peripherals_Sensors (R6.2)
USB_RX: 000_STM (U1.31), 300_Power (U5.18)
USB_TX: 000_STM (U1.30), 300_Power (U5.17)